# Altium project PCB_Project.PrjPcb
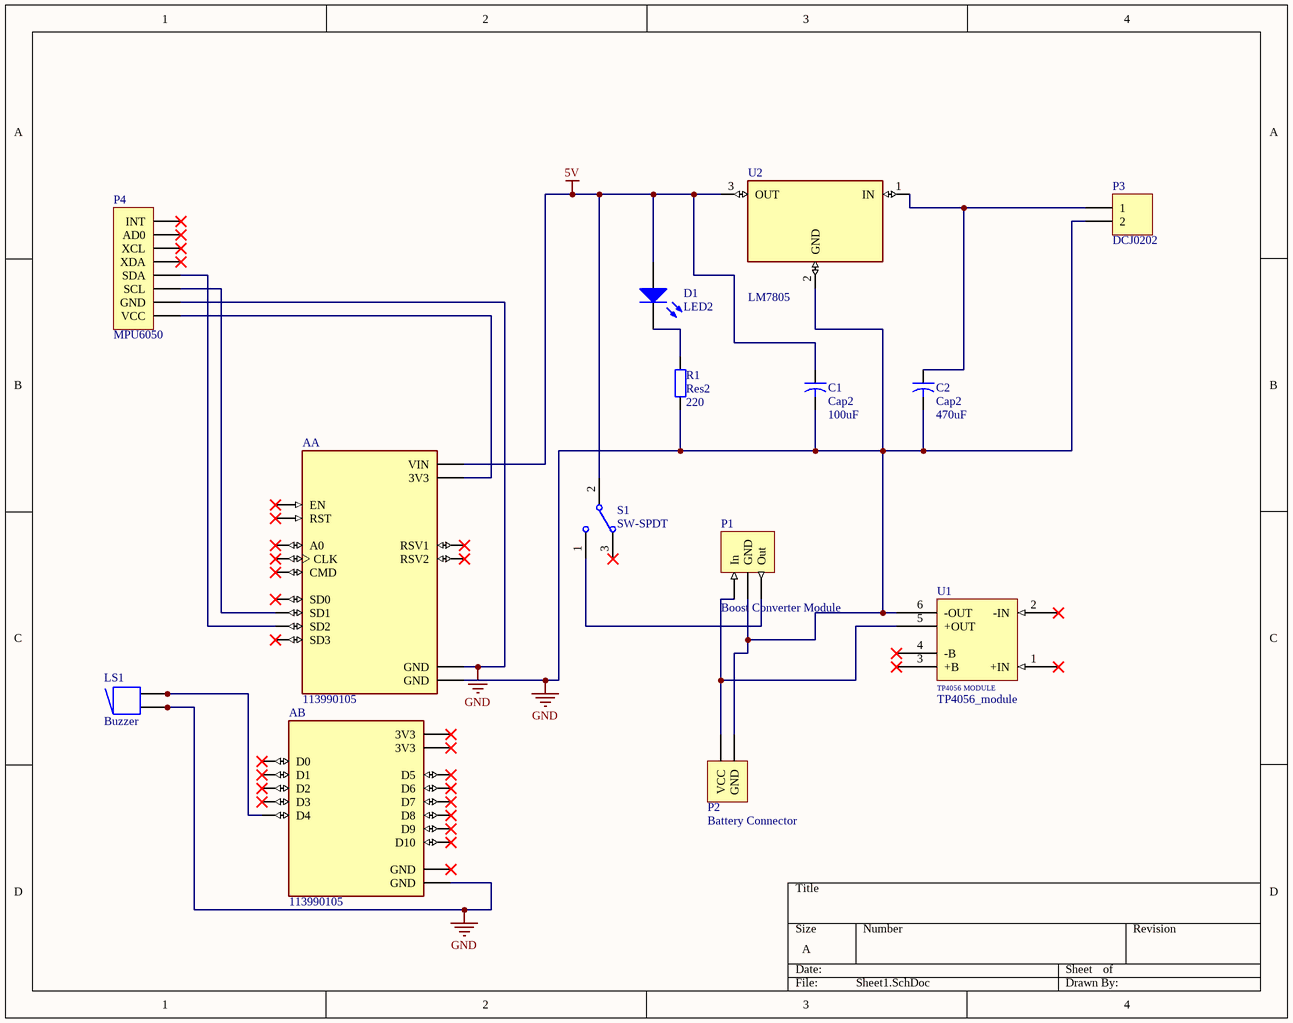
[diagram p0: Sheet1.SchDoc]
1 sheet, 13 parts. Net scope: global (net labels, ports and power ports of the same name join across sheets).
Board file: PCB1.PcbDoc

## Sheet Sheet1.SchDoc
size A; SheetNumber: 1; SheetTotal: 1

### Parts
A  113990105  [SEEED_113990105]  (parts A,B of 2)
C1  Cap2  value 100uF  [CAPR5-4X5]
C2  Cap2  value 470uF  [CAPR5-4X5]
D1  LED2  [3.2X1.6X1.1]
LS1  Buzzer  [ABSM-1574]
P1  Boost Converter Module  [HDR1X3]
P2  Battery Connector  [HDR1X2]
P3  DCJ0202  [HDR1X2]
P4  MPU6050  [HDR1X8]
R1  Res2  value 220  [AXIAL-0.4]
S1  SW-SPDT  [TL36WW15050]
U1  TP4056_module  [PCBComponent_1]
U2  LM7805  [TO220]

### Nets
5V: A.J1_15(VIN) C1.1 D1.1(A) S1.2 U2.3(OUT)
GND: A.J1_10(GND) A.J1_14(GND) A.J2_14(GND) C1.2 C2.2 LS1.1 LS1.1A P1.2(GND) P2.2(GND) P3.2 P4.2(GND) R1.1 U1.6(-OUT) U2.2(GND)
NetA_J1_5: A.J1_5(SD2) P4.4(SDA)
NetA_J1_6: A.J1_6(SD1) P4.3(SCL)
NetA_J1_11: A.J1_11(3V3) P4.1(VCC)
NetA_J2_5: A.J2_5(D4) LS1.2 LS1.2A
NetC2_1: C2.1 P3.1 U2.1(IN)
NetD1_2: D1.2(K) R1.2
NetP1_1: P1.1(In) P2.1(VCC) U1.5(+OUT)
NetP1_3: P1.3(Out) S1.1

Not connected (* = marked no-connect by the designer): A J1_1(A0)* J1_2(RSV1)* J1_3(RSV2)* J1_4(SD3)* J1_7(CMD)* J1_8(SD0)* J1_9(CLK)* J1_12(EN)* J1_13(RST)* J2_1(D0)* J2_2(D1)* J2_3(D2)* J2_4(D3)* J2_6(3V3)* J2_7(GND)* J2_8(D5)* J2_9(D6)* J2_10(D7)* J2_11(D8)* J2_12(D9)* J2_13(D10)* J2_15(3V3)*; P4 5(XDA)* 6(XCL)* 7(AD0)* 8(INT)*; S1 3*; U1 1(+IN)* 2(-IN)* 3(+B)* 4(-B)*

### Notes on the sheet
- (in symbol TP4056_module) TP4056 MODULE

### Library data of the parts
A = 113990105: An open-source firmware and development kit that helps you to Prototype your IOT product within a few Lua script lines; MP: NodeMCU v2; MF: Seeed Technology; Availability: Unavailable; SnapEDA_Link: https://www.snapeda.com/parts/NodeMCU%20v2/Seeed%20Technology%20Co.%2C%20Ltd/view-part/378076/?ref=snap; Price: None; Value: *; Package: None
C1 C2 = Cap2: Capacitor; Published: 23-Sep-2002; PackageReference: CAPR5-4X5; Publisher: Altium Limited; PackageDescription: Capacitor; 2 Leads
D1 = LED2: Typical RED, GREEN, YELLOW, AMBER GaAs LED; Published: 8-Jun-2000; LatestRevisionDate: 17-Jul-2002; LatestRevisionNote: Re-released for DXP Platform.; PackageVersion: Feb-2002; PackageReference: 3.2X1.6X1.1; Publisher: Altium Limited; PackageDescription: SM LED; 2 Flat Leads
LS1 = Buzzer: Magnetic Transducer Buzzer; Published: 24-Mar-1999; LatestRevisionDate: 17-Dec-2003; LatestRevisionNote: Schematic revised, PCB Footprint replaced.; DatasheetVersion: 17-Dec-2003; PackageReference: ABSM-1574; Publisher: Altium Limited; PackageDescription: Magnetic Transducer Buzzer; ComponentLink1Description: Manufacturer Link; ComponentLink1URL: http://www.megastar.com/linecard/buzzmode/index.php
P1 = Header 3: Header, 3-Pin; LatestRevisionDate: 17-Jul-2002; LatestRevisionNote: Re-released for DXP Platform.; Publisher: Altium Limited
P2 P3 = Header 2: Header, 2-Pin; LatestRevisionDate: 17-Jul-2002; LatestRevisionNote: Re-released for DXP Platform.; Publisher: Altium Limited
P4 = Header 8: Header, 8-Pin; LatestRevisionDate: 17-Jul-2002; LatestRevisionNote: Re-released for DXP Platform.; Publisher: Altium Limited
R1 = Res2: Resistor; Published: 8-Jun-2000; LatestRevisionDate: 17-Jul-2002; LatestRevisionNote: Re-released for DXP Platform.; PackageReference: AXIAL-0.4; Publisher: Altium Limited; PackageDescription: Axial Device, Thru-Hole; 2 Leads; 0.4 in Pin Spacing
S1 = SW-SPDT: SPDT Subminiature Toggle Switch, Right Angle Mounting, Vertical Actuation; Published: 24-Mar-1999; LatestRevisionDate: 17-Dec-2003; LatestRevisionNote: Schematic revised, PCB Footprint replaced.; DatasheetVersion: 05-Dec-2000; PackageReference: TL36WW15050; Publisher: Altium Limited; PackageDescription: Switch; 4 Leads; ComponentLink1Description: Manufacturer Link; ComponentLink1URL: http://www.apem.com
U2 = LM7805: Linear Voltage Regulator IC 1 Output 1.5A SOT-223-4; MF: Texas Instruments; Availability: Unavailable; SnapEDA_Link: https://www.snapeda.com/parts/LM7805/Texas%20Instruments/view-part/2302466/?ref=snap; MP: LM7805; Price: None; Value: *; Package: TO-220 Texas Instruments